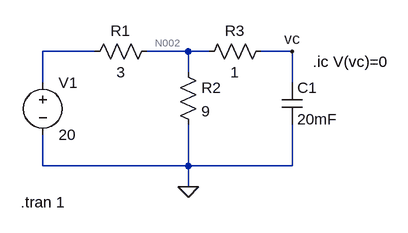
[diagram p0: schematic sadiku_chapter7_example_72_withSource.asc]
sadiku_chapter7_example_72_withSource.asc, the LTspice schematic file:
Version 4
SHEET 1 880 680
WIRE 112 96 32 96
WIRE 256 96 192 96
WIRE 288 96 256 96
WIRE 416 96 368 96
WIRE 256 128 256 96
WIRE 32 144 32 96
WIRE 416 144 416 96
WIRE 32 272 32 224
WIRE 256 272 256 208
WIRE 256 272 32 272
WIRE 416 272 416 208
WIRE 416 272 256 272
WIRE 256 304 256 272
FLAG 256 304 0
FLAG 416 96 vc
SYMBOL voltage 32 128 R0
WINDOW 123 0 0 Left 0
WINDOW 39 0 0 Left 0
SYMATTR InstName V1
SYMATTR Value 20
SYMBOL res 208 80 R90
WINDOW 0 0 56 VBottom 2
WINDOW 3 32 56 VTop 2
SYMATTR InstName R1
SYMATTR Value 3
SYMBOL res 240 112 R0
SYMATTR InstName R2
SYMATTR Value 9
SYMBOL res 384 80 R90
WINDOW 0 0 56 VBottom 2
WINDOW 3 32 56 VTop 2
SYMATTR InstName R3
SYMATTR Value 1
SYMBOL cap 400 144 R0
SYMATTR InstName C1
SYMATTR Value 20mF
TEXT 448 112 Left 2 !.ic V(vc)=0
TEXT -2 328 Left 2 !.tran 1

The netlist it stands for:
* sadiku_chapter7_example_72_withSource.asc
V1 N001 0 20
R1 N002 N001 3
R2 N002 0 9
R3 vc N002 1
C1 vc 0 20mF
.ic V(vc)=0
.tran 1
.backanno
.end

* Results of the author's LTspice run, read from the files saved beside the schematic
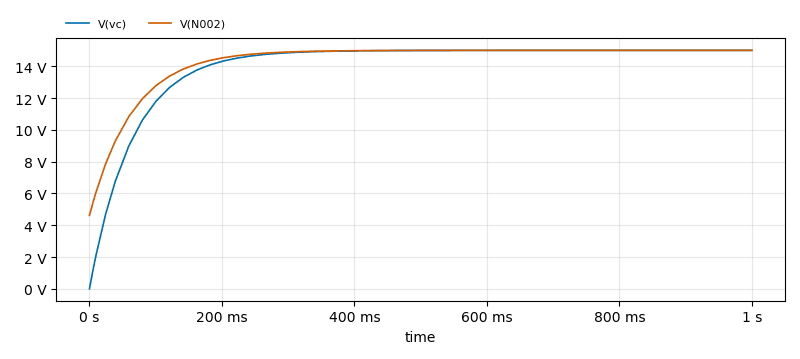
[diagram p1: Transient Analysis of sadiku_chapter7_example_72_withSource.asc, plotted from the saved traces]
* Transient Analysis, 1 run:
*   V(vc): min 0 V, max 15 V, average 14.02 V, rms 14.25 V, last 15 V
*   V(N002): min 4.615 V, max 15 V, average 14.32 V, rms 14.43 V, last 15 V